# EAGLE design latdr32 (EAGLE 9.6.2)
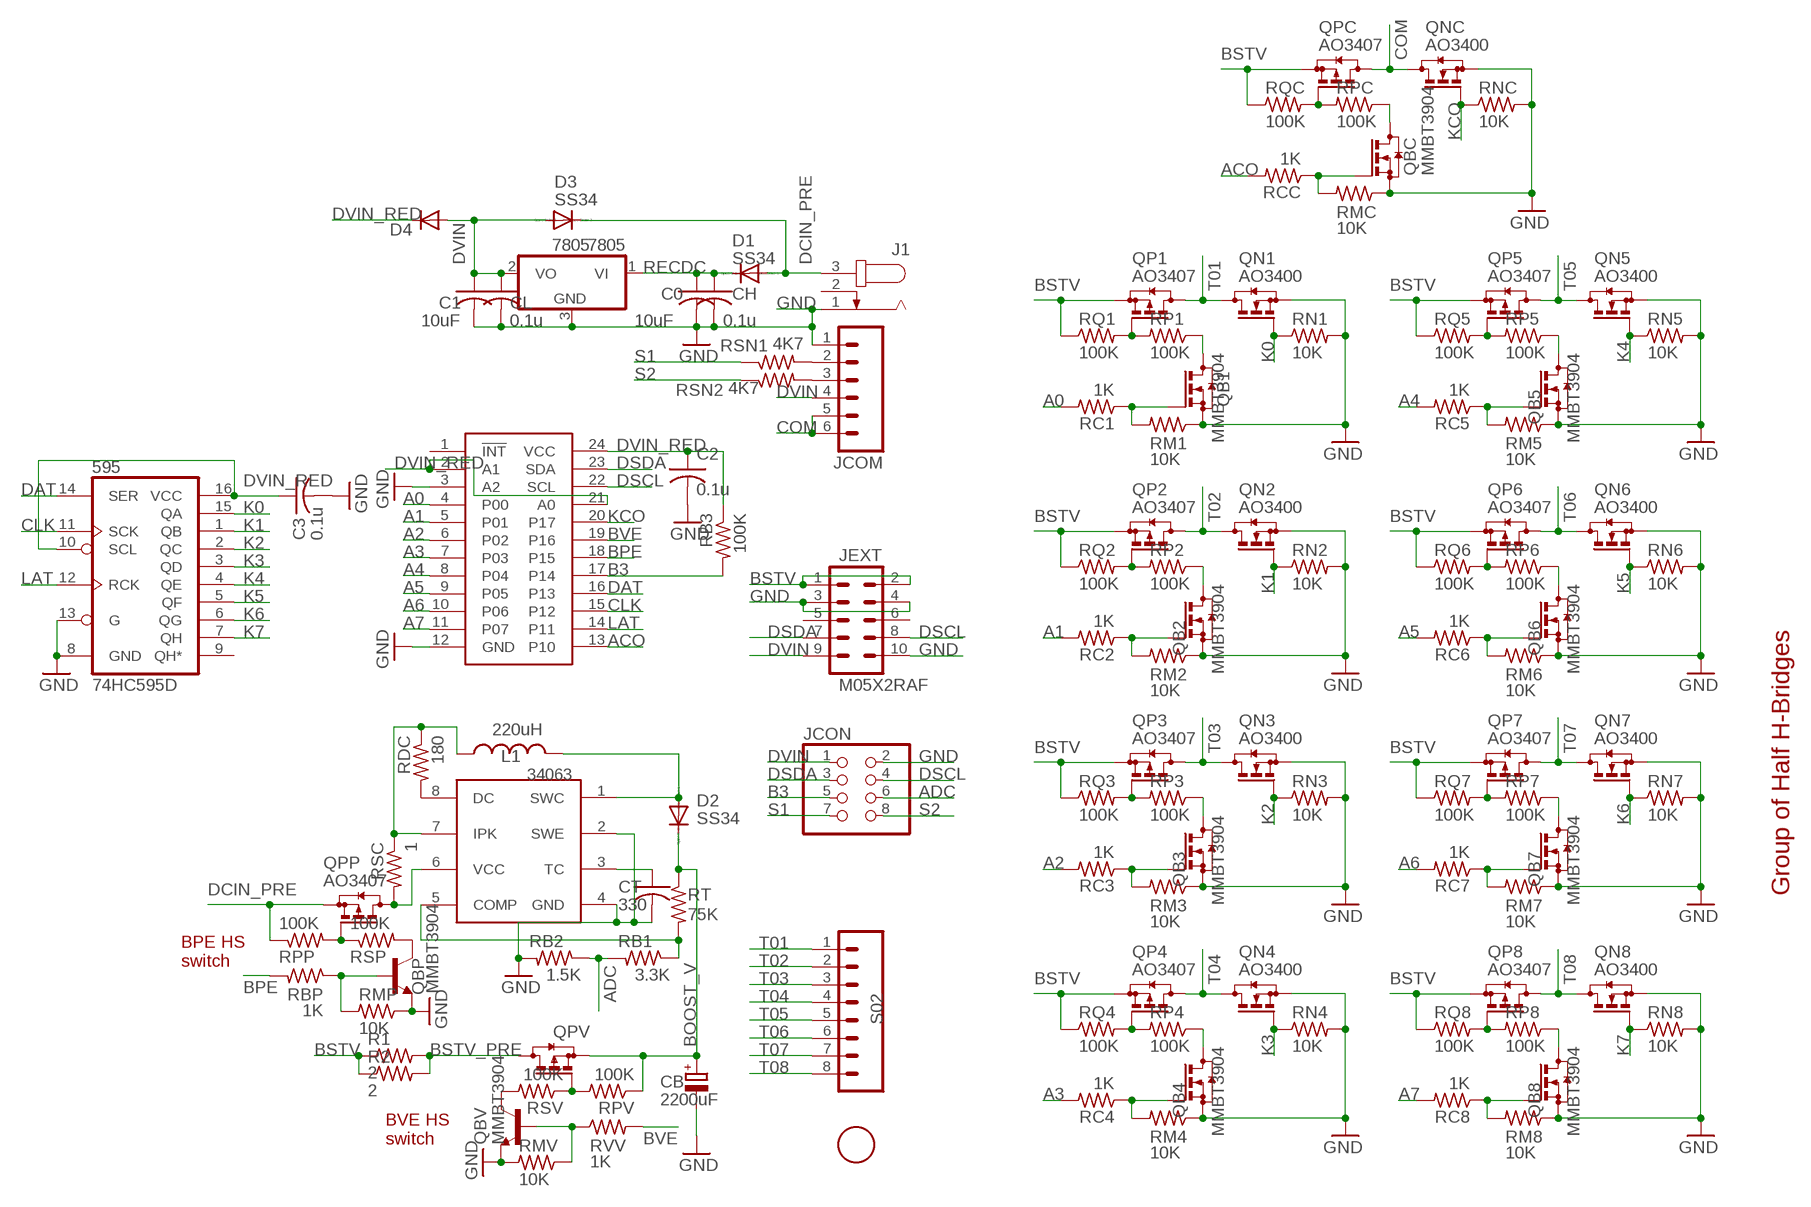
[diagram p0: schematic, sheet 1]

## Parts
1F  FIDUCIAL  [FIDUCIAL_1MM]
595  74HC595D  74LS595D  [SO16]
7805  7805  7805DT  [TO252]
34063  MC34063  MC33063/MC34063D  [SO08]
C0  10uF  C-USC0805K  [C0805K]
C1  10uF  C-USC0805K  [C0805K]
C2  0.1u  C-USC0603  [C0603]
C3  0.1u  C-USC0603  [C0603]
CB  2200uF  CPOL-EUE7.5-16  [E7,5-16]
CH  0.1u  C-USC0603  [C0603]
CL  0.1u  C-USC0603  [C0603]
CT  330  C-USC0603K  [C0603K]
D1  SS34  DIODE-SMB  [SMB]
D2  SS34  DIODE-SMB  [SMB]
D3  SS34  DIODE-SMB  [SMB]
D4  DIODESMA  [SMA-DIODE]
J1  JACK-PLUG0  [SPC4077]
JCOM  M065MM  [SCREWTERMINAL-5MM-6]
JCON  PINHD-2X4  [2X04]
JEXT  M05X2RAF  [2X5-RAF]
L1  220uH  INDUCTORCR54  [CR54]
PCA9555  PCA9555  PCF8575TSSOP24  [TSSOP24]
QB1  MMBT3904  BSS123  [SOT23]
QB2  MMBT3904  BSS123  [SOT23]
QB3  MMBT3904  BSS123  [SOT23]
QB4  MMBT3904  BSS123  [SOT23]
QB5  MMBT3904  BSS123  [SOT23]
QB6  MMBT3904  BSS123  [SOT23]
QB7  MMBT3904  BSS123  [SOT23]
QB8  MMBT3904  BSS123  [SOT23]
QBC  MMBT3904  BSS123  [SOT23]
QBP  MMBT3904  TRANSISTOR_NPNSOT23-3  [SOT23-3]
QBV  MMBT3904  TRANSISTOR_NPNSOT23-3  [SOT23-3]
QN1  AO3400  BSS123  [SOT23]
QN2  AO3400  BSS123  [SOT23]
QN3  AO3400  BSS123  [SOT23]
QN4  AO3400  BSS123  [SOT23]
QN5  AO3400  BSS123  [SOT23]
QN6  AO3400  BSS123  [SOT23]
QN7  AO3400  BSS123  [SOT23]
QN8  AO3400  BSS123  [SOT23]
QNC  AO3400  BSS123  [SOT23]
QP1  AO3407  BSS84  [SOT23]
QP2  AO3407  BSS84  [SOT23]
QP3  AO3407  BSS84  [SOT23]
QP4  AO3407  BSS84  [SOT23]
QP5  AO3407  BSS84  [SOT23]
QP6  AO3407  BSS84  [SOT23]
QP7  AO3407  BSS84  [SOT23]
QP8  AO3407  BSS84  [SOT23]
QPC  AO3407  BSS84  [SOT23]
QPP  AO3407  BSS84  [SOT23]
QPV  AO3407  BSS84  [SOT23]
R1  2  R-US_R2512  [R2512]
R2  2  R-US_R2512  [R2512]
RB1  3.3K  R-US_R0603  [R0603]
RB2  1.5K  R-US_R0603  [R0603]
RB3  100K  R-US_R0603  [R0603]
RBP  1K  R-US_R0603  [R0603]
RC1  1K  R-US_R0603  [R0603]
RC2  1K  R-US_R0603  [R0603]
RC3  1K  R-US_R0603  [R0603]
RC4  1K  R-US_R0603  [R0603]
RC5  1K  R-US_R0603  [R0603]
RC6  1K  R-US_R0603  [R0603]
RC7  1K  R-US_R0603  [R0603]
RC8  1K  R-US_R0603  [R0603]
RCC  1K  R-US_R0603  [R0603]
RDC  180  R-US_R0603  [R0603]
RM1  10K  R-US_R0603  [R0603]
RM2  10K  R-US_R0603  [R0603]
RM3  10K  R-US_R0603  [R0603]
RM4  10K  R-US_R0603  [R0603]
RM5  10K  R-US_R0603  [R0603]
RM6  10K  R-US_R0603  [R0603]
RM7  10K  R-US_R0603  [R0603]
RM8  10K  R-US_R0603  [R0603]
RMC  10K  R-US_R0603  [R0603]
RMP  10K  R-US_R0603  [R0603]
RMV  10K  R-US_R0603  [R0603]
RN1  10K  R-US_R0603  [R0603]
RN2  10K  R-US_R0603  [R0603]
RN3  10K  R-US_R0603  [R0603]
RN4  10K  R-US_R0603  [R0603]
RN5  10K  R-US_R0603  [R0603]
RN6  10K  R-US_R0603  [R0603]
RN7  10K  R-US_R0603  [R0603]
RN8  10K  R-US_R0603  [R0603]
RNC  10K  R-US_R0603  [R0603]
RP1  100K  R-US_R0603  [R0603]
RP2  100K  R-US_R0603  [R0603]
RP3  100K  R-US_R0603  [R0603]
RP4  100K  R-US_R0603  [R0603]
RP5  100K  R-US_R0603  [R0603]
RP6  100K  R-US_R0603  [R0603]
RP7  100K  R-US_R0603  [R0603]
RP8  100K  R-US_R0603  [R0603]
RPC  100K  R-US_R0603  [R0603]
RPP  100K  R-US_R0603  [R0603]
RPV  100K  R-US_R0603  [R0603]
RQ1  100K  R-US_R0603  [R0603]
RQ2  100K  R-US_R0603  [R0603]
RQ3  100K  R-US_R0603  [R0603]
RQ4  100K  R-US_R0603  [R0603]
RQ5  100K  R-US_R0603  [R0603]
RQ6  100K  R-US_R0603  [R0603]
RQ7  100K  R-US_R0603  [R0603]
RQ8  100K  R-US_R0603  [R0603]
RQC  100K  R-US_R0603  [R0603]
RSC  1  R-US_R0603  [R0603]
RSN1  4K7  R-US_R0603  [R0603]
RSN2  4K7  R-US_R0603  [R0603]
RSP  100K  R-US_R0603  [R0603]
RSV  100K  R-US_R0603  [R0603]
RT  75K  R-US_R0603  [R0603]
RVV  1K  R-US_R0603  [R0603]
S02  M085MM-8  [SCREWTERMINAL-5MM-8]

## Nets
A0: PCA9555.4(P00) RC1.2
A1: PCA9555.5(P01) RC2.2
A2: PCA9555.6(P02) RC3.2
A3: PCA9555.7(P03) RC4.2
A4: PCA9555.8(P04) RC5.2
A5: PCA9555.9(P05) RC6.2
A6: PCA9555.10(P06) RC7.2
A7: PCA9555.11(P07) RC8.2
ACO: PCA9555.13(P10) RCC.2
ADC [signal]: JCON.6 RB1.2 RB2.1
B3 [signal]: JCON.5 PCA9555.17(P14) RB3.2
BOOST_V: CB.+ D2.C QPV.2(S) RPV.1 RT.1
BPE: PCA9555.18(P15) RBP.2
BSTV [power]: JEXT.1 JEXT.2 QP1.2(S) QP2.2(S) QP3.2(S) QP4.2(S) QP5.2(S) QP6.2(S) QP7.2(S) QP8.2(S) QPC.2(S) R1.1 R2.1 RQ1.1 RQ2.1 RQ3.1 RQ4.1 RQ5.1 RQ6.1 RQ7.1 RQ8.1 RQC.1
BSTV_PRE [power]: QPV.3(D) R1.2 R2.2
BVE: PCA9555.19(P16) RVV.2
CLK: 595.11(SCK) PCA9555.15(P12)
COM [power]: JCOM.5 JCOM.6 QNC.3(D) QPC.3(D)
DAT: 595.14(SER) PCA9555.16(P13)
DCIN_PRE: D1.A D3.C J1.3 QPP.2(S) RPP.1
DSCL [signal]: JCON.4 JEXT.8 PCA9555.22(SCL)
DSDA [signal]: JCON.3 JEXT.7 PCA9555.23(SDA)
DVIN [power]: 7805.2(VO) C1.1 CL.1 D3.A D4.A JCOM.4 JCON.1 JEXT.9
DVIN_RED [power]: 595.10(SCL) 595.16(VCC) C2.1 C3.1 D4.C PCA9555.2(A1) PCA9555.21(A0) PCA9555.24(VCC) RB3.1
GND: 595.8(GND) 595.13(G) 7805.3(GND) 34063.2(SWE) 34063.4(GND) C0.2 C1.2 C2.2 C3.2 CB.- CH.2 CL.2 CT.2 J1.1 JCOM.1 JCON.2 JEXT.3 JEXT.4 JEXT.10 PCA9555.3(A2) PCA9555.12(GND) QB1.2(S) QB2.2(S) QB3.2(S) QB4.2(S) QB5.2(S) QB6.2(S) QB7.2(S) QB8.2(S) QBC.2(S) QBP.2(E) QBV.2(E) QN1.2(S) QN2.2(S) QN3.2(S) QN4.2(S) QN5.2(S) QN6.2(S) QN7.2(S) QN8.2(S) QNC.2(S) RB2.2 RM1.1 RM2.1 RM3.1 RM4.1 RM5.1 RM6.1 RM7.1 RM8.1 RMC.1 RMP.1 RMV.2 RN1.2 RN2.2 RN3.2 RN4.2 RN5.2 RN6.2 RN7.2 RN8.2 RNC.2
K0: 595.15(QA) QN1.1(G) RN1.1
K1: 595.1(QB) QN2.1(G) RN2.1
K2: 595.2(QC) QN3.1(G) RN3.1
K3: 595.3(QD) QN4.1(G) RN4.1
K4: 595.4(QE) QN5.1(G) RN5.1
K5: 595.5(QF) QN6.1(G) RN6.1
K6: 595.6(QG) QN7.1(G) RN7.1
K7: 595.7(QH) QN8.1(G) RN8.1
KCO: PCA9555.20(P17) QNC.1(G) RNC.1
LAT: 595.12(RCK) PCA9555.14(P11)
N$1: 34063.1(SWC) D2.A L1.P$2
N$2: JCOM.2 RSN1.2
N$3: JCOM.3 RSN2.2
N$4: QBC.3(D) RPC.1
N$5: QB1.3(D) RP1.1
N$6: QB2.1(G) RC2.1 RM2.2
N$7: QBC.1(G) RCC.1 RMC.2
N$8: QB5.3(D) RP5.1
N$9: QB2.3(D) RP2.1
N$10: QB3.3(D) RP3.1
N$11: QB1.1(G) RC1.1 RM1.2
N$12: QB4.1(G) RC4.1 RM4.2
N$13: QB3.1(G) RC3.1 RM3.2
N$14: QB6.3(D) RP6.1
N$15: QB7.3(D) RP7.1
N$16: QB4.3(D) RP4.1
N$17: 34063.3(TC) CT.1
N$18: QB8.3(D) RP8.1
N$19: QB5.1(G) RC5.1 RM5.2
N$23: QB6.1(G) RC6.1 RM6.2
N$24: 34063.8(DC) RDC.2
N$26: 34063.7(IPK) L1.P$1 RDC.1 RSC.1
N$27: 34063.6(VCC) QPP.3(D) RSC.2
N$28: QBP.1(B) RBP.1 RMP.2
N$29: 34063.5(COMP) RB1.1 RT.2
N$30: QPP.1(G) RPP.2 RSP.1
N$33: QB7.1(G) RC7.1 RM7.2
N$34: QBV.3(C) RSV.2
N$35: QBP.3(C) RSP.2
N$38: QPV.1(G) RPV.2 RSV.1
N$40: QB8.1(G) RC8.1 RM8.2
N$50: QBV.1(B) RMV.1 RVV.1
N$200: QPC.1(G) RPC.2 RQC.2
N$201: QP1.1(G) RP1.2 RQ1.2
N$202: QP2.1(G) RP2.2 RQ2.2
N$203: QP3.1(G) RP3.2 RQ3.2
N$204: QP4.1(G) RP4.2 RQ4.2
N$205: QP5.1(G) RP5.2 RQ5.2
N$206: QP6.1(G) RP6.2 RQ6.2
N$207: QP7.1(G) RP7.2 RQ7.2
N$208: QP8.1(G) RP8.2 RQ8.2
RECDC: 7805.1(VI) C0.1 CH.1 D1.C
S1: JCON.7 RSN1.1
S2: JCON.8 RSN2.1
T01 [power]: QN1.3(D) QP1.3(D) S02.1
T02 [power]: QN2.3(D) QP2.3(D) S02.2
T03 [power]: QN3.3(D) QP3.3(D) S02.3
T04 [power]: QN4.3(D) QP4.3(D) S02.4
T05 [power]: QN5.3(D) QP5.3(D) S02.5
T06 [power]: QN6.3(D) QP6.3(D) S02.6
T07 [power]: QN7.3(D) QP7.3(D) S02.7
T08 [power]: QN8.3(D) QP8.3(D) S02.8
Unconnected: 595.9(QH*) J1.2 JEXT.5 JEXT.6 PCA9555.1(!INT)

## Notes on the sheet
- Group of Half H-Bridges
- BPE HS
  switch
- BVE HS
  switch

## Library data of the parts
1F = adafruitGood:FIDUCIAL: For use by pick and place machines to calibrate the vision/machine, 1mm By microbuilder.eu
595 = SparkFun:74*595: 8-bit SHIFT REGISTER, output latch
7805 = linear:78*: Positive VOLTAGE REGULATOR Source: http://cache.national.com/ds/LM/LM78L05.pdf http://www.fairchildsemi.com/ds/LM/LM7805.pdf
34063 = adafruit:MC33063/MC34063: MC33063 and MC34063 Basic DC/DC converter with internal power-NPN transistor, 100KHz, 1.5A peak switch current. 3-40 input/output.
C0 C1-C3 CH CL CT = adafruit:C-US: CAPACITOR, American symbol
CB = rcl:CPOL-EU: POLARIZED CAPACITOR, European symbol
D1-D3 = diode:DIODE-: DIODE
D4 = SparkFunNew:DIODE: Diode These are standard reverse protection diodes and small signal diodes. SMA package can handle up to about 1A. SOD-323 can handle about 200mA. What the SOD-323 package when ordering, there are some mfgs out there that are 5-pin packages.
J1 = con-jack:JACK-PLUG: DC POWER JACK Power Jack, DC, Right Angle, Through Hole, Rated 5A at 16VDC, PC Terminals Distributor: Farnell (www.Farnell.de) Drawing: 84N1161.pdf / 84N1162.pdf Manufacturer: SPC Technology (www.spctechnology.com) Type: SPC4077 / SPC 4078; OC_FARNELL: unknown; OC_NEWARK: unknown
JCOM = SparkFun:M06: Header 6 Standard 6-pin 0.1" header. Use with straight break away headers (SKU : PRT-00116), right angle break away headers (PRT-00553), swiss pins (PRT-00743), machine pins (PRT-00117), and female headers (PRT-00115). Molex polarized connector foot print use with SKU : PRT-08094 with associated crimp pins and housings. NOTES ON THE VARIANTS LOCK and LOCK_LONGPADS... This footprint was designed to help hold the alignment of a through-hole component (i.e. 6-pin header) while soldering it into place. You may notice that each hole has been shifted either up or down by 0.005 of an inch from it's more standard position (which is a perfectly straight line). This slight alteration caused the pins (the squares in the middle) to touch the edges of the holes. Because they are alternating, it causes a "brace" to hold the component in place. 0.005 has proven to be the perfect amount of "off-center" position when using our standard breakaway headers. Although looks a little odd when you look at the bare footprint, once you have a header in there, the alteration is very hard to notice. Also, if you push a header all the way into place, it is covered up entirely on the bottom side. This idea of altering the position of holes to aid alignment will be further integrated into the Sparkfun Library for other footprints. It can help hold any component with 3 or more connection pins.
JCON = pinhead:PINHD-2X4: PIN HEADER
JEXT = SparkFunNew:M05X2: Header 5x2 Standard 10-pin dual row 0.1" header. Commonly used with AVR-ISP. Use with Spark Fun Electronics SKU: PRT-00778
L1 = SparkFunNew:INDUCTOR: Inductors Basic Inductor/Choke - 0603 and 1206. Footprints are not proven and vary greatly between part numbers.
PCA9555 = SparkFunNew:PCF8575
QB1-QB8 QBC QN1-QN8 QNC = transistor-small-signal:BSS123: N-CHANNEL MOS FET
QBP QBV = SparkFunNew:TRANSISTOR_NPN: Transistor NPN BJT configuration in SOT23 package. MMBT2222 is the common NPN we use. Double check BCE configuration again layout.
QP1-QP8 QPC QPP QPV = transistor-small-signal:BSS84: P-CHANNEL MOS FET
R1 R2 RSN1 RSN2 = adafruit2013:R-US_: RESISTOR, American symbol
RB1-RB3 RBP RC1-RC8 RCC RDC RM1-RM8 RMC RMP RMV RN1-RN8 RNC RP1-RP8 RPC RPP RPV RQ1-RQ8 RQC RSC RSP RSV RT RVV = adafruitGood:R-US_: RESISTOR, American symbol
S02 = SparkFun:M08: Header 8 Standard 8-pin 0.1" header. Use with straight break away headers (SKU : PRT-00116), right angle break away headers (PRT-00553), swiss pins (PRT-00743), machine pins (PRT-00117), and female headers (PRT-00115).

## Net classes
0 default: width 0.254 mm, clearance 0.178 mm
1 power: width 0.254 mm, clearance 0.178 mm
2 relaypower: width 0.508 mm, clearance 0.305 mm
3 signal: width 0.254 mm, clearance 0.178 mm
4 adc: width 0.254 mm, clearance 0.178 mm

## Board
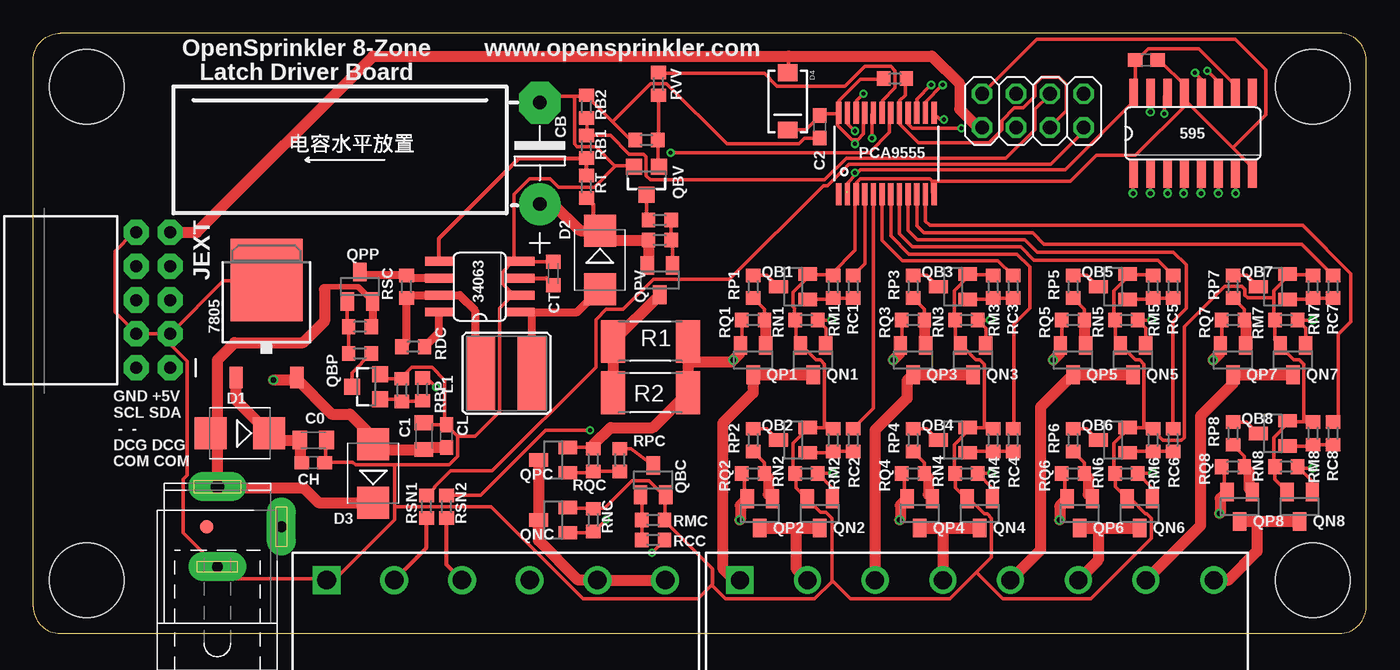
[diagram p1: board, top side]
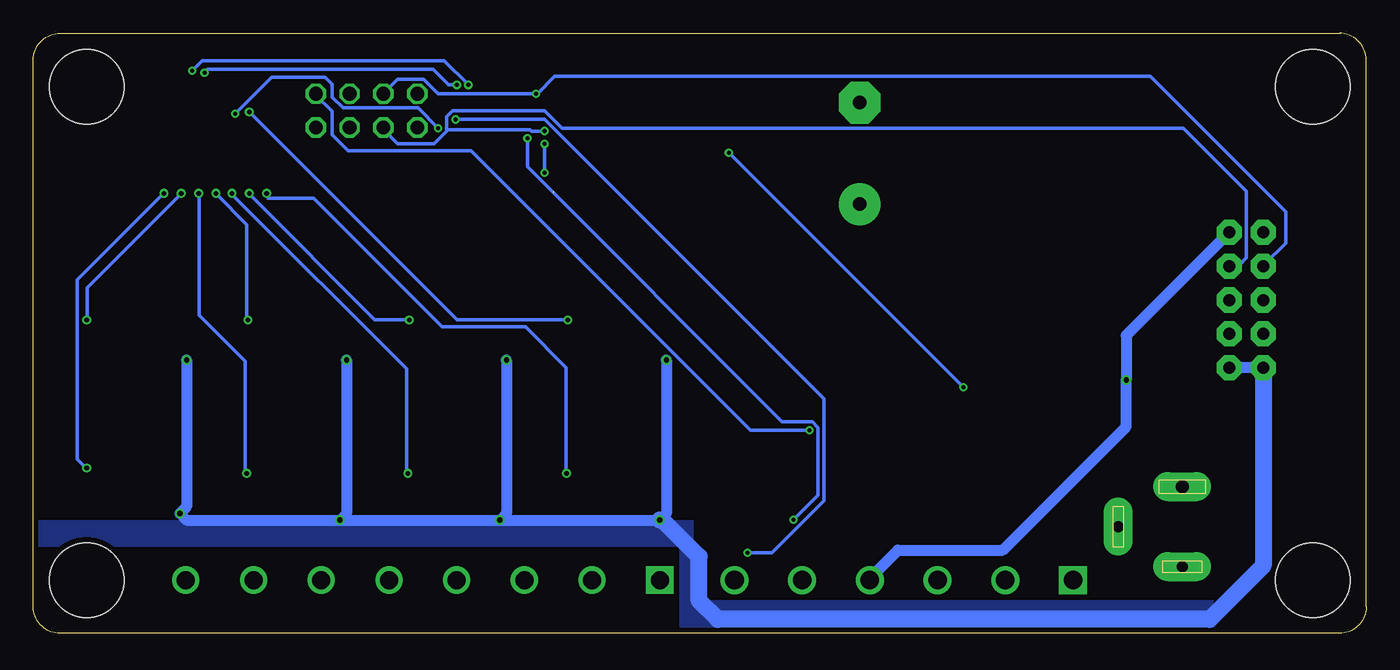
[diagram p2: board, bottom side, seen from below]

Size 100 x 45 mm. Coordinates in mm from the lower left corner, seen from the top.
Outline: 2,0 98,0 arc90 100,2 100,43 arc90 98,45 2,45 arc90 0,43 0,2 arc90 2,0
Copper layers (1*16): Top 0.035mm / dielectric 1.5mm / Bottom 0.035mm
Design rules "Fusion_eagle_rule_v1.1 *": minimum track width 6mil, minimum drill 12mil, track to track 6mil, track to pad 6mil, pad to pad 6mil, via to via 6mil, smd to smd 0mil, copper to edge 10mil, drill to drill 10mil, minimum pad ring 10mil, minimum via ring 6mil, stop-mask expansion 2mil, vias tented up to drill 100mil, thermal gap 40mil
Holes 5.6 mm at 4,4 96,4 4,41 96,41

### Footprints (pad centres in the part's own frame; a part is rotated, then mirrored left to right if it is on the bottom)
FIDUCIAL_1MM = smd 1 x 1: 1 0,0
SO16 = smd 0.66 x 2.032: 1 -4.445,-3.073; 2 -3.175,-3.073; 3 -1.905,-3.073; 4 -0.635,-3.073; 5 0.635,-3.073; 6 1.905,-3.073; 7 3.175,-3.073; 8 4.445,-3.073; 9 4.445,3.073; 10 3.175,3.073; 11 1.905,3.073; 12 0.635,3.073; 13 -0.635,3.073; 14 -1.905,3.073; 15 -3.175,3.073; 16 -4.445,3.073
TO252 = smd 1 x 1.6: 1 -2.28,-4.8; 2 2.28,-4.8 | smd 5.4 x 6.2: 3 0,2.5
SO08 = smd 0.66 x 2.032: 1 -1.905,-3.073; 2 -0.635,-3.073; 3 0.635,-3.073; 4 1.905,-3.073; 5 1.905,3.073; 6 0.635,3.073; 7 -0.635,3.073; 8 -1.905,3.073
C0805K = smd 1.1 x 1.4: 1 -1,0; 2 1,0
C0603 = smd 1.1 x 1: 1 -0.85,0; 2 0.85,0
E7,5-16 = drill 1.016 pad 3.15: + -3.81,0 | drill 1.016 pad 3.15 octagon: - 3.81,0
C0603K = smd 1.05 x 1.08: 1 -0.875,0; 2 0.875,0
SMB = smd 2.4 x 2.4: A 2.2,0; C -2.2,0
SMA-DIODE = smd 1.27 x 1.47: A 2.15,0; C -2.15,0
SPC4077 = drill 0.8 pad 2.184 long: 1 -3,0; 2 0,-4.8 | drill 1 pad 2.184 long: 3 3,0
SCREWTERMINAL-5MM-6 = drill 1.4 pad 2.032 square: 1 0,0 | drill 1.4 pad 2.032: 2 5.08,0; 3 10.16,0; 4 15.24,0; 5 20.32,0; 6 25.4,0
2X04 = drill 1.016 octagon: 1 -3.81,-1.27; 2 -3.81,1.27; 3 -1.27,-1.27; 4 -1.27,1.27; 5 1.27,-1.27; 6 1.27,1.27; 7 3.81,-1.27; 8 3.81,1.27
2X5-RAF = drill 0.9 pad 1.88 octagon: 1 -1.27,5.08; 2 1.27,5.08; 3 -1.27,2.54; 4 1.27,2.54; 5 -1.27,0; 6 1.27,0; 7 -1.27,-2.54; 8 1.27,-2.54; 9 -1.27,-5.08; 10 1.27,-5.08
CR54 = smd 5.5 x 2.15: P$1 0,1.92; P$2 0,-1.92
TSSOP24 = smd 0.4 x 1.65: 1 -3.575,-3.05; 2 -2.925,-3.05; 3 -2.275,-3.05; 4 -1.625,-3.05; 5 -0.975,-3.05; 6 -0.325,-3.05; 7 0.325,-3.05; 8 0.975,-3.05; 9 1.625,-3.05; 10 2.275,-3.05; 11 2.925,-3.05; 12 3.575,-3.05; 13 3.575,3.05; 14 2.925,3.05; 15 2.275,3.05; 16 1.625,3.05; 17 0.975,3.05; 18 0.325,3.05; 19 -0.325,3.05; 20 -0.975,3.05; 21 -1.625,3.05; 22 -2.275,3.05; 23 -2.925,3.05; 24 -3.575,3.05
SOT23 = smd 1 x 1.4: 1 -0.95,-1.1; 2 0.95,-1.1; 3 0,1.1
SOT23-3 = smd 1.2 x 1.2: 1 1,-0.95; 2 1,0.95; 3 -1.1,0
R2512 = smd 1.8 x 3.2: 1 -2.8,0; 2 2.8,0
R0603 = smd 1 x 1.1: 1 -0.85,0; 2 0.85,0
SCREWTERMINAL-5MM-8 = drill 1.35 pad 2.032 square: 1 0,0 | drill 1.35 pad 2.032: 2 5.08,0; 3 10.16,0; 4 15.24,0; 5 20.32,0; 6 25.4,0; 7 30.48,0; 8 35.56,0

### Placement (x,y rotation side)
1F  13,8 0 top
595  87,37.5 0 top
7805  17.5,24 0 top
34063  33.5,26 90 top
C0  21,14.5 0 top
C1  29.3,14.8 90 top
C2  59,38 270 top
C3  83.5,43 0 top
CB  38,36 90 top
CH  21,12.8 0 top
CL  31,14.8 90 top
CT  39,27 90 top
D1  15.5,15 180 top
D2  42.5,28 270 top
D3  25.5,12 90 top
D4  56.6,39.9 90 top
J1  13.8,8 90 top
JCOM  22,4 0 top
JCON  75,39.2 0 top
JEXT  9,25 180 top
L1  35.5,19.5 90 top
PCA9555  64,36 0 top
QB1  57,26 90 top
QB2  57,14.5 90 top
QB3  69,26 90 top
QB4  69,14.5 90 top
QB5  81,26 90 top
QB6  81,14.5 90 top
QB7  93,26 90 top
QB8  93,15 90 top
QBC  46.5,11.5 0 top
QBP  25,18.5 0 top
QBV  46,34 90 top
QN1  58.5,20.5 180 top
QN2  59,9 180 top
QN3  70.5,20.5 180 top
QN4  71,9 180 top
QN5  82.5,20.5 180 top
QN6  83,9 180 top
QN7  94.5,20.5 180 top
QN8  95,9.5 180 top
QNC  39,8.5 90 top
QP1  54,20.5 180 top
QP2  54.5,9 180 top
QP3  66,20.5 180 top
QP4  66.5,9 180 top
QP5  78,20.5 180 top
QP6  78.5,9 180 top
QP7  90,20.5 180 top
QP8  90.5,9.5 180 top
QPC  39,13 90 top
QPP  24.5,26 0 top
QPV  47,26.5 180 top
R1  46.3,21.9 180 top
R2  46.3,18.05 180 top
RB1  41.5,36.5 90 top
RB2  41.5,39.5 90 top
RB3  64.65,41.6 0 top
RBP  29.2,18.3 90 top
RC1  61.5,26 90 top
RC2  61.5,14.5 90 top
RC3  73.5,26 90 top
RC4  73.5,14.5 90 top
RC5  85.5,26 90 top
RC6  85.5,14.5 90 top
RC7  97.5,26 90 top
RC8  97.5,15 90 top
RCC  46.5,7 0 top
RDC  28.5,21.5 0 top
RM1  60,26 270 top
RM2  60,14.5 270 top
RM3  72,26 270 top
RM4  72,14.5 270 top
RM5  84,26 270 top
RM6  84,14.5 270 top
RM7  96,26 270 top
RM8  96,15 270 top
RMC  46.5,8.5 180 top
RMP  27.65,18.25 270 top
RMV  46,37 180 top
RN1  58,23.5 180 top
RN2  58,12 180 top
RN3  70,23.5 180 top
RN4  70,12 180 top
RN5  82,23.5 180 top
RN6  82,12 180 top
RN7  94,23.5 180 top
RN8  94,12.5 180 top
RNC  42,8.5 90 top
RP1  54,26 270 top
RP2  54,14.5 270 top
RP3  66,26 270 top
RP4  66,14.5 270 top
RP5  78,26 270 top
RP6  78,14.5 270 top
RP7  90,26 270 top
RP8  90,15 270 top
RPC  44,13 270 top
RPP  24.5,23 180 top
RPV  47,29.5 0 top
RQ1  54,23.5 0 top
RQ2  54,12 0 top
RQ3  66,23.5 0 top
RQ4  66,12 0 top
RQ5  78,23.5 0 top
RQ6  78,12 0 top
RQ7  90,23.5 0 top
RQ8  90,12.5 0 top
RQC  42,13 270 top
RSC  28,26 90 top
RSN1  29.5,9.5 270 top
RSN2  31,9.5 270 top
RSP  24.5,21 0 top
RSV  47,31 180 top
RT  41.5,33.5 90 top
RVV  46.9,41.2 90 top
S02  53,4 0 top

### Tracks (layer width: path | path; a pad name or v marks a point on that pad's centre or on a via)
A0
  Top 0.254: PCA9555.4 62.38,27.73 RC1.2
A1
  Top 0.254: PCA9555.5 63.02,16.88 RC2.2
A2
  Top 0.254: PCA9555.6 63.67,29.48 65.19,27.95 72.38,27.95 73.48,26.85 RC3.2
A3
  Top 0.254: PCA9555.7 64.33,29.82 65.7,28.45 73.8,28.45 74.75,27.5 74.75,24.4 73.55,23.2 73.55,15.4 RC4.2
A4
  Top 0.254: PCA9555.8 64.97,29.98 65.97,28.98 74.08,28.98 75.06,28 84.35,28 RC5.2
A5
  Top 0.254: PCA9555.9 65.62,30.23 66.34,29.51 74.41,29.51 75.32,28.6 85.53,28.6 86.5,27.63 86.5,24.37 85.5,23.37 RC6.2
A6
  Top 0.254: PCA9555.10 66.28,30.57 66.81,30.05 74.99,30.05 75.83,29.2 95.15,29.2 RC7.2
A7
  Top 0.254: PCA9555.11 66.92,30.93 67.25,30.6 95.23,30.6 98.86,26.98 98.86,23.37 97.9,22.42 97.9,16.25 RC8.2
ACO  (via drill 0.3)
  Top 0.254: v46.42,6.04 47.28,6.91 RCC.2 | v68.33,38.54 68.01,38.54 67.58,38.97 PCA9555.13
  Bottom 0.254: v46.42,6.04 44.58,6.04 40.7,9.93 40.7,17.6 61.64,38.54 v68.33,38.54
ADC
  Top 0.254: RB2.1 41.56,38.65 41.56,37.35 RB1.2 41.67,37.35 43.29,37.35 44.69,35.95 45.77,35.95 45.99,35.73 45.99,34.33 46.31,34 59.37,34 60.99,35.62 72.97,35.62 75.13,37.78 75.13,39.29 76.21,40.37 JCON.6
B3
  Top 0.254: RB3.2 65.42,41.56 65.42,40.37 64.99,39.94 64.99,39.08 PCA9555.17 64.99,38.97 64.99,38.21 66.39,36.81 71.68,36.81 72.65,37.78 72.65,38.43 73.62,39.4 74.27,39.4 75.13,40.27 75.13,41.16 75.68,41.71 76.95,41.71 77.5,41.16 77.5,39.18 76.32,38 JCON.5
BOOST_V
  Top 0.305: RT.1 42,32.15 42,30.7 D2.C
  Top 0.813: QPV.2 46.15,27.7 RPV.1 43.2,29.5 D2.C 41,30.2 39.01,32.19 CB.+
BPE  (via drill 0.3)
  Top 0.254: v30.23,18.46 29.58,19.11 29.25,19.11 RBP.2 | v47.82,36.05 62.72,36.05 64.23,37.57 64.23,38.97 PCA9555.18
  Bottom 0.254: v47.82,36.05 v30.23,18.46
BSTV  (via drill 0.4)
  Top 0.254: RQ2.1 53.35,11.8 53.35,10.3 QP2.2 | RQ1.1 53.15,21.7 QP1.2 | RQ3.1 65.15,21.7 QP3.2 | RQ4.1 65.35,11.8 65.35,10.3 QP4.2 | RQ5.1 77.15,21.7 QP5.2 | RQ6.1 77.4,11.75 77.4,10.25 QP6.2 | RQ7.1 89.15,21.7 QP7.2 | RQ8.1 89.35,12.3 89.35,10.8 QP8.2 | QPC.2 41.9,13.95 RQC.1
  Top 0.813: QP1.2 53.05,21.05 v52.5,20.5 52.35,20.35 49.1,20.35 | QP2.2 53.05,9.6 53.05,8.55 v53,8.5 | QP3.2 65.05,21.05 v64.5,20.5 | QP4.2 65.05,9.6 65.05,8.55 v65,8.5 | QP5.2 77.05,21.05 v76.5,20.5 | QP6.2 77.05,9.6 77.05,9.55 77,9.5 v77,8.5 | QP7.2 89.05,21.05 v88.5,20.5 | QP8.2 89.05,10.1 89.05,9.05 v89,9 | R1.1 49.1,20.35 | 49.1,20.35 R2.1 46.48,15.43 43.31,15.43 42,14.13 RQC.1
  Bottom 0.813: v52.5,20.5 52.5,9 v53,8.5 v65,8.5 | v64.5,20.5 64.5,9 v65,8.5 | v76.5,20.5 76.5,9 v77,8.5 | v88.5,20.5 88.5,9.5 v89,9 88.5,8.5 v77,8.5 | v77,8.5 v65,8.5 | JEXT.2 JEXT.1
  Bottom 1.27: JEXT.2 7.73,5.07 11.75,1.05 48.65,1.05 50.05,2.45 50.05,5.75 52.8,8.5 v53,8.5
  pour Bottom (isolate 0.406): 100,8.5 50.5,8.5 50.5,2.5 11.5,2.5 11.5,0 51.5,0 51.5,6.5 100,6.5
BSTV_PRE
  Top 0.813: QPV.3 R1.2 R2.2
BVE
  Top 0.254: RVV.2 46.96,41.99 54.84,41.99 55.81,41.02 60.88,41.02 62.4,42.53 64.34,42.53 64.66,42.21 64.66,40.91 63.69,39.94 63.69,39.08 PCA9555.19
CLK  (via drill 0.3)
  Top 0.254: v67.36,41.13 66.28,40.05 66.28,39.08 PCA9555.15 | v88.07,42.2 88.84,41.43 88.84,40.59 595.11
  Bottom 0.254: v67.36,41.13 69.17,42.94 87.33,42.94 v88.07,42.2
COM
  Top 0.813: QPC.3 QNC.3 37.9,6.97 40.87,4 JCOM.5 JCOM.6
DAT  (via drill 0.3)
  Top 0.254: v69.63,37.89 65.96,37.89 65.63,38.21 65.63,38.97 PCA9555.16 | v84.85,38.97 84.85,40.27 85.06,40.48 595.14
  Bottom 0.254: v69.63,37.89 71.14,39.4 76.75,39.4 77.57,40.22 77.57,41.16 78.12,41.71 82.11,41.71 v84.85,38.97
DCIN_PRE
  Top 0.305: 22.03,25.98 21.85,25.8
  Top 0.406: QPP.2 24.37,25.98 22.03,25.98
  Top 0.61: QPP.2 25.45,23.1 RPP.1
  Top 0.813: D3.C 21.4,9.8 20.3,10.9 13.9,10.9 J1.3 13.8,14.5 D1.A 13.8,15.5 13.8,20.5 15.1,21.8 20.25,21.8 21.85,23.4 21.85,25.8
DSCL  (via drill 0.3)
  Top 0.254: v62.29,40.48 61.75,39.94 61.75,39.08 PCA9555.22
  Bottom 0.254: JCON.4 73.73,40.48 72.65,41.56 70.71,41.56 69.63,40.48 v62.29,40.48 62.18,40.48 60.88,41.78 16.2,41.78 6.04,31.62 6.04,29.25 7.66,27.64 JEXT.8
DSDA  (via drill 0.3)
  Top 0.254: v61.64,37.67 61.1,38.21 61.1,38.97 PCA9555.23
  Bottom 0.254: v61.64,37.67 62.61,37.67 62.72,37.78 68.87,37.78 | 68.87,37.78 69.94,36.71 72.65,36.71 73.73,37.79 JCON.3 | JEXT.7 10.26,27.64 9.5,27.64 8.98,28.16 8.98,33.16 13.71,37.89 60.34,37.89 61.64,39.19 68.55,39.19 68.98,38.75 68.98,37.78 68.87,37.78
DVIN  (via drill 0.4)
  Top 0.254: 56.67,43.3 56.67,42.1 D4.A
  Top 0.813: CL.1 29.45,13.95 C1.1 29.25,13.75 25.9,13.75 25.5,14.15 D3.A 25.5,14.7 23.75,16.45 22.38,16.45 19.78,19.05 7805.2 19.58,19 v18,19 | JEXT.9 12.27,30.08 25.49,43.3 56.67,43.3 67.4,43.3 69.5,41.2 69.5,39.32 70.89,37.93 JCON.1
  Bottom 0.813: JEXT.9 18,22.35 v18,19 18,15.5 27.27,6.23 35.14,6.23 37.24,4.13 JCOM.4
DVIN_RED  (via drill 0.3)  (1 unrouted)
  Top 0.254: 60.99,33.03 PCA9555.2 | PCA9555.21 62.29,38.97 62.29,37.46 61.85,37.03 61.64,37.03 | PCA9555.24 60.34,38.97 59.27,38.97 C2.1 58.94,38.75 57.97,37.78 56.67,37.78 D4.C | RB3.1 63.8,41.56 62.07,41.56 60.45,39.94 60.45,39.08 PCA9555.24 | 61.64,37.03 61.42,37.03 60.34,38.11 60.34,38.86 PCA9555.24 | 60.99,33.14 60.99,33.68 61.8,34.49 | 61.8,34.49 62.07,34.76 77.43,34.76 82.47,39.8 82.47,40.48 595.16 82.69,40.8 82.69,42.96 C3.1 82.8,42.96 83.66,43.83 87.44,43.83 90.14,41.13 90.14,40.59 595.10 | v61.64,36.7 61.64,37.03 | v61.64,34.54 61.75,34.54 61.8,34.49
  Bottom 0.254: v61.64,34.54 v61.64,36.7
GND
  Top 0.254: 40.59,40.27 38.54,40.27 38.11,39.83 CB.- | 40.59,40.27 41.45,40.27 RB2.2 41.56,40.27 43.45,38.38 | 43.45,38.38 44.8,37.03 45.12,37.03 RMV.2 | 43.45,38.38 46.31,41.24 47.5,41.24 52.03,36.7 57.43,36.7 57.86,37.13 58.94,37.13 C2.2 | 43.61,35.08 45.02,35.08 QBV.2 | 43.61,35.08 42.21,36.49 40.8,36.49 40.59,36.7 40.59,40.27 | JEXT.3 10.26,22.45 7.77,22.45 JEXT.4 7.66,22.56 6.13,24.1 6.13,28.67 7.54,30.08 JEXT.10 | 7805.3 17.49,26.45 14.25,26.45 10.36,22.56 JEXT.3 | CT.2 38.97,27.85 36.59,27.85 34063.4 | 34063.4 36.49,27.85 35.95,27.85 35.19,27.09 35.19,26.23 36.05,25.37 36.49,25.37 34063.2 35.95,25.37 34.98,24.4 34.98,16.62 33.14,14.79 31.84,14.79 | C0.2 21.91,14.46 21.91,12.85 CH.2 22.02,12.85 23.96,12.85 24.18,12.63 27.09,12.63 | QBP.2 26.02,19.43 26.34,19.11 27.64,19.11 RMP.1 27.64,19.21 28.39,19.97 29.9,19.97 30.87,19 30.87,15.76 CL.2 | CL.2 30.98,15.65 29.47,15.65 29.36,15.76 C1.2 | 27.09,12.63 31.2,12.63 31.84,13.28 31.84,14.79 | 31.84,14.79 31.09,15.54 CL.2 | 27.09,12.63 27.09,9.5 | 27.09,9.5 27.09,8.53 22.67,4.1 22.02,4.1 JCOM.1 21.91,4.1 14.68,4.1 13.82,4.97 J1.1 13.71,5.07 11.23,7.56 11.23,11.55 11.55,11.87 11.55,20.4 10.26,21.7 10.26,22.35 JEXT.3 | 43.61,35.08 43.61,34.98 42.1,33.47 39.4,33.47 38.75,34.11 37.24,34.11 36.05,32.92 36.05,27.96 34063.4 | C3.2 84.65,42.84 86.36,41.13 86.36,40.59 595.13 | 90,36.41 86.47,39.94 86.47,40.48 595.13 | 90,36.41 91.43,34.98 595.8 | 90,36.41 92.48,38.9 92.48,42.28 90.2,44.56 75.3,44.56 71.21,40.47 JCON.2 | 95.32,15.87 94.13,15.87 QB8.2 94.13,15.76 93.05,14.68 93.05,12.52 RN8.2 93.16,12.41 93.16,11.55 94.02,10.69 QN8.2
  Top 0.254: 95.32,15.87 95.97,15.87 RM8.1 | RM7.1 95.97,26.88 94.13,26.88 QB7.2 94.13,26.77 93.05,25.69 93.05,25.15 | 93.05,25.15 93.05,23.53 RN7.2 93.16,23.43 93.16,22.02 93.48,21.7 QN7.2 93.59,21.48 94.56,20.51 95,20.51 95.32,20.19 95.32,15.87 | 83.34,15.44 82.15,15.44 QB6.2 82.15,15.33 81.07,14.25 81.07,12.09 RN6.2 81.18,11.98 81.18,11.01 82.04,10.15 QN6.2 82.15,10.04 82.37,10.04 83.44,8.96 83.55,8.96 83.88,8.64 83.88,7.12 79.34,2.59 72.76,2.59 70.76,4.59 | 83.34,15.44 83.98,15.44 RM6.1 83.98,15.22 84.74,14.46 86.14,14.46 86.36,14.68 86.36,22.99 89.38,26.02 90.68,26.02 90.89,25.8 90.89,25.37 91.11,25.15 93.05,25.15 | RM5.1 83.98,26.88 82.15,26.88 QB5.2 82.15,26.77 81.07,25.69 81.07,23.53 RN5.2 81.18,23.43 81.18,22.02 81.5,21.7 QN5.2 81.61,21.59 82.69,20.51 83.01,20.51 83.34,20.19 83.34,15.44 | 71.36,15.44 70.17,15.44 QB4.2 70.06,15.33 70.06,15.11 69.09,14.14 69.09,12.09 RN4.2 69.2,11.98 69.2,10.9 69.95,10.15 QN4.2 70.17,10.15 71.36,8.96 71.57,8.96 71.89,8.64 71.89,5.72 70.76,4.59 | 71.36,15.44 71.89,15.44 RM4.1 | RM3.1 71.89,26.88 70.17,26.88 QB3.2 70.17,26.77 69.09,25.69 69.09,23.53 RN3.2 69.2,23.43 69.2,22.02 69.52,21.7 QN3.2 69.63,21.59 70.71,20.51 71.03,20.51 71.36,20.19 71.36,15.44 | QNC.2 40.16,9.39 41.99,9.39 RNC.2 42.1,9.39 42.86,9.39 44.91,11.44 46.2,11.44 47.28,10.36 QBC.2 47.39,10.36 47.39,8.53 RMC.1 47.39,8.42 50.95,4.86 50.95,3.56 | 59.37,15.44 58.19,15.44 QB2.2 58.08,15.33 57,14.25 57,12.2 57.11,12.09 RN2.2 57.21,11.98 57.21,10.9 57.97,10.15 QN2.2 58.08,10.04 59.05,9.07 59.48,9.07 59.91,8.64 59.91,3.89
  Top 0.254: 59.37,15.44 59.91,15.44 RM2.1 | 67.47,33.9 67.47,33.03 PCA9555.12 | 67.47,33.9 67.25,34.11 62.07,34.11 61.75,33.79 61.75,33.03 PCA9555.3 61.64,32.92 61.64,28.71 59.91,26.99 RM1.1 59.91,26.88 58.19,26.88 QB1.2 58.19,26.77 57,25.58 57,24.5 57.11,24.4 57.11,23.53 RN1.2 57.21,23.43 57.21,22.02 57.54,21.7 QN1.2 57.65,21.59 58.73,20.51 59.05,20.51 59.37,20.19 59.37,15.44 | 50.95,3.56 51.92,2.59 58.62,2.59 59.91,3.89 | 70.76,4.59 68.76,2.59 61.32,2.59 60.02,3.89 59.91,3.89 | 67.47,33.9 77.81,33.9 79.75,35.84 82.69,35.84 86.58,39.73 595.13 | 27.09,9.5 34.33,9.5 41.24,2.59 49.87,2.59 50.84,3.56 50.95,3.56
K0  (via drill 0.35)
  Top 0.254: 595.15 83.8,40.55 v83.8,39.1 | QN1.1 59.45,22.9 RN1.1 v59.9,23.5
  Bottom 0.254: v59.9,23.5 59.91,23.53 68.22,23.53 83.77,39.08 v83.8,39.1
K1  (via drill 0.35)
  Top 0.254: 595.1 82.5,34.37 v82.5,33 | QN2.1 59.95,10.9 RN2.1 v60,12
  Bottom 0.254: v82.5,33 82.37,32.62 78.96,32.62 69.32,22.98 63.08,22.98 60.02,19.91 60.02,12.09 v60,12
K2  (via drill 0.35)
  Top 0.254: 595.2 83.8,34.4 v83.8,33 | QN3.1 71.45,22.9 RN3.1 v71.8,23.5
  Bottom 0.254: v71.8,23.5 71.89,23.53 74.38,23.53 83.77,32.92 v83.8,33
K3  (via drill 0.35)
  Top 0.254: 595.3 v85.1,33 | QN4.1 71.95,10.9 RN4.1 v71.9,12
  Bottom 0.254: v85.1,33 85.06,32.92 85.06,32.89 72,19.83 72,12.09 v71.9,12
K4  (via drill 0.35)
  Top 0.254: 595.4 86.3,34.36 v86.3,33 | QN5.1 83.45,22.9 RN5.1 v83.9,23.5
  Bottom 0.254: v83.9,23.5 83.98,23.53 83.98,30.66 86.25,32.92 v86.3,33
K5  (via drill 0.35)
  Top 0.254: 595.5 87.6,34.39 v87.6,33 | QN6.1 83.95,10.9 RN6.1 v84,12
  Bottom 0.254: v87.6,33 87.55,32.92 87.55,23.85 84.09,20.4 84.09,12.09 v84,12
K6  (via drill 0.35)
  Top 0.254: 595.6 v88.9,33 | QN7.1 95.45,22.9 RN7.1 v96,23.5
  Bottom 0.254: v96,23.5 95.97,23.53 95.97,25.91 88.95,32.92 v88.9,33
K7  (via drill 0.35)
  Top 0.254: 595.7 90.2,34.4 v90.2,33 | QN8.1 95.95,11.4 RN8.1 94.95,12.4 v96,12.4
  Bottom 0.254: v90.2,33 90.22,33 96.72,26.5 96.72,13.06 96.08,12.41 v96,12.4
KCO  (via drill 0.3)
  Top 0.254: QNC.1 40.16,7.56 41.99,7.56 RNC.1 42.1,7.66 v42.96,8.53 | v62.94,37.13 62.94,38.97 PCA9555.20
  Bottom 0.254: v62.94,37.13 62.94,34.98 43.83,15.87 41.56,15.87 41.13,15.44 41.13,10.36 v42.96,8.53
LAT  (via drill 0.3)
  Top 0.254: v68.22,41.13 66.93,39.83 66.93,39.08 PCA9555.14 | v87.16,42.04 87.61,41.59 87.61,41.28 87.64,41.25 595.12
  Bottom 0.254: v68.22,41.13 68.83,41.13 69.99,42.29 86.91,42.29 v87.16,42.04
N$1
  Top 0.61: 34063.1 37.25,24.09 | 37.25,24.09 40.8,24.09 D2.A | L1.P$2 37.42,23.93 37.25,24.09
N$2
  Top 0.305: JCOM.2 29.5,6.42 RSN1.2
N$3
  Top 0.305: JCOM.3 31,5.16 RSN2.2
N$4
  Top 0.254: RPC.1 44.85,13.85 QBC.3
N$5
  Top 0.254: RP1.1 55.05,26.85 QB1.3
N$6
  Top 0.254: QB2.1 59.9,13.55 RM2.2 RC2.1
N$7
  Top 0.254: RCC.1 RMC.2 45.65,10.3 QBC.1
N$8
  Top 0.254: RP5.1 79.05,26.85 QB5.3
N$9
  Top 0.254: RP2.1 55.05,15.35 QB2.3
N$10
  Top 0.254: RP3.1 67.05,26.85 QB3.3
N$11
  Top 0.254: QB1.1 59.9,25.05 RM1.2 RC1.1
N$12
  Top 0.254: QB4.1 70.2,13.65 RM4.2 RC4.1
N$13
  Top 0.254: QB3.1 71.9,25.05 RM3.2 RC3.1
N$14
  Top 0.254: RP6.1 79.05,15.35 QB6.3
N$15
  Top 0.254: RP7.1 91.05,26.85 QB7.3
N$16
  Top 0.254: RP4.1 67.05,15.35 QB4.3
N$17
  Top 0.305: 34063.3 38.49,26.64 CT.1
N$18
  Top 0.254: RP8.1 91.05,15.85 QB8.3
N$19
  Top 0.254: QB5.1 83.9,25.05 RM5.2 RC5.1
N$23
  Top 0.254: QB6.1 82.2,13.65 RM6.2 RC6.1
N$24
  Top 0.61: RDC.2 30.43,22.58 34063.8
N$26
  Top 0.61: RDC.1 28,21.85 RSC.1 28.21,25.36 34063.7 31.98,25.36 33.13,24.22 33.13,19.95 L1.P$1
N$27
  Top 0.61: QPP.3 24.75,26.85 RSC.2 28.21,26.64 34063.6
N$28
  Top 0.254: RBP.1 29.15,17.4 RMP.2 27.5,17.55 QBP.1
N$29
  Top 0.305: 34063.5 30.43,29.63 36.45,35.65 RB1.1 RT.2
N$30
  Top 0.254: QPP.1 23.55,23.1 RPP.2 RSP.1
N$33
  Top 0.254: QB7.1 95.9,25.05 RM7.2 RC7.1
N$34
  Top 0.254: QBV.3 46,31.15 RSV.2
N$35
  Top 0.254: QBP.3 23.9,19.55 RSP.2
N$38
  Top 0.254: QPV.1 47.95,29.4 RPV.2 RSV.1
N$40
  Top 0.254: QB8.1 95.9,14.05 RM8.2 RC8.1
N$50
  Top 0.254: RVV.1 46.9,37.05 RMV.1 46.85,35.1 QBV.1
N$200
  Top 0.254: QPC.1 41.9,12.05 RQC.2 RPC.2
N$201
  Top 0.254: RP1.2 54.85,24.3 RQ1.2 54.95,23.4
  Top 0.813: QP1.1 54.95,23.4
N$202
  Top 0.254: RP2.2 54.85,12.8 RQ2.2 55.15,11.7 | 55.15,10.4 QP2.1
  Top 0.813: 55.15,11.7 55.15,10.4
N$203
  Top 0.254: RP3.2 66.85,24.3 RQ3.2 | 66.85,21.7 QP3.1
  Top 0.813: RQ3.2 66.85,21.7
N$204
  Top 0.254: RP4.2 66.85,12.8 RQ4.2 67.15,11.7 | QP4.1 67.15,10.4
  Top 0.813: 67.15,11.7 67.15,10.4
N$205
  Top 0.254: RP5.2 78.85,24.3 RQ5.2 | 78.85,21.7 QP5.1
  Top 0.813: RQ5.2 78.85,21.7
N$206
  Top 0.254: RP6.2 78.85,12.8 RQ6.2 79.15,11.7 | 79.15,10.4 QP6.1
  Top 0.813: 79.15,11.7 79.15,10.4
N$207
  Top 0.254: RP7.2 90.85,24.3 RQ7.2 90.95,23.4
  Top 0.813: 90.95,23.4 QP7.1
N$208
  Top 0.254: RP8.2 90.85,13.3 RQ8.2 91.2,12.15 | 91.2,10.85 QP8.1
  Top 0.813: 91.2,12.15 91.2,10.85
RECDC
  Top 0.813: 7805.1 15.22,17.48 D1.C 18.2,14.5 C0.1 20,12.95 CH.1
S1
  Top 0.254: RSN1.1 29.58,10.36 30.12,10.9 30.12,11.01 31.3,12.2 34.44,12.2 42.21,19.97 42.21,23.53 42.96,24.29 44.26,24.29 46.53,26.56 52.25,26.56 59.27,33.57 59.59,33.57 61.21,35.19 76.36,35.19 78.75,37.59 JCON.7
S2  (via drill 0.3)
  Top 0.254: v41.78,15.22 38.43,15.22 33.57,10.36 31.09,10.36 RSN2.1
  Bottom 0.254: v41.78,15.22 46.2,15.22 67.16,36.18 76.37,36.18 77.57,37.38 77.57,39.14 78.8,40.37 JCON.8
T01
  Top 0.813: QN1.3 QP1.3 54,18.03 51.72,15.74 51.72,4.88 52.6,4 S02.1
T02
  Top 0.813: QP2.3 QN2.3 57.23,7.9 57.23,4.85 S02.2
T03
  Top 0.813: QN3.3 QP3.3 65.54,18.94 65.54,17.62 63.16,15.24 S02.3
T04
  Top 0.813: QP4.3 QN4.3 68.24,7.9 S02.4
T05
  Top 0.813: QN5.3 QP5.3 75.57,16.97 75.57,6.25 S02.5
T06
  Top 0.813: QP6.3 79.9,7.9 | 79.9,7.9 QN6.3 | S02.6 79.9,5.5 79.9,7.9
T07
  Top 0.813: QN7.3 QP7.3 90,18.73 87.57,16.29 87.57,8.09 S02.7
T08
  Top 0.813: QN8.3 QP8.3 91.62,8.4 91.81,8.21 91.81,6.15 89.66,4 S02.8

### Text on the board
tNames: OpenSprinkler 8-Zone | www.opensprinkler.com | Latch Driver Board | GND +5V / SCL SDA / - - / DCG DCG / COM COM